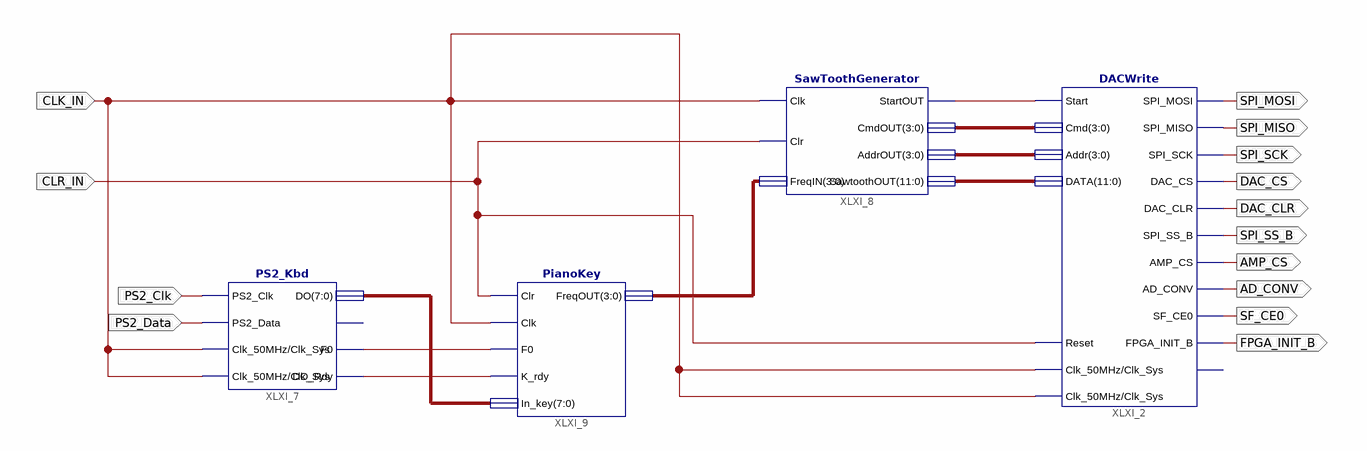
[diagram p0: schematic sheet 1]
// Xilinx ISE schematic SawToothSchematic.sch (spartan3e) as structural Verilog: 4 symbols, 14 ports
module SawToothSchematic (
  input  PS2_Clk,
  input  PS2_Data,
  input  CLK_IN,
  input  CLR_IN,
  output SPI_MOSI,
  output SPI_SCK,
  output SPI_MISO,
  output DAC_CS,
  output DAC_CLR,
  output SPI_SS_B,
  output AMP_CS,
  output AD_CONV,
  output SF_CE0,
  output FPGA_INIT_B
);

  wire XLXN_13, XLXN_45, XLXN_46;
  wire [3:0] XLXN_14, XLXN_15, XLXN_17;
  wire [7:0] XLXN_44;
  wire [11:0] XLXN_16;

  DACWrite XLXI_2 (
    .Reset(CLR_IN), .Start(XLXN_13), .SPI_MISO(SPI_MISO), .Cmd(XLXN_14), .Addr(XLXN_15), .DATA(XLXN_16),
    .DAC_CLR(DAC_CLR), .DAC_CS(DAC_CS), .SPI_MOSI(SPI_MOSI), .SPI_SCK(SPI_SCK), .SPI_SS_B(SPI_SS_B),
    .AMP_CS(AMP_CS), .AD_CONV(AD_CONV), .SF_CE0(SF_CE0), .FPGA_INIT_B(FPGA_INIT_B), .Clk_50MHz(CLK_IN),
    .Clk_Sys(CLK_IN));  // open: Busy
  PS2_Kbd XLXI_7 (
    .PS2_Clk(PS2_Clk), .PS2_Data(PS2_Data), .Clk_50MHz(CLK_IN), .F0(XLXN_45), .DO_Rdy(XLXN_46), .DO(XLXN_44),
    .Clk_Sys(CLK_IN));  // open: E0
  SawToothGenerator XLXI_8 (
    .Clk(CLK_IN), .Clr(CLR_IN), .FreqIN(XLXN_17), .StartOUT(XLXN_13), .CmdOUT(XLXN_14), .AddrOUT(XLXN_15),
    .SawtoothOUT(XLXN_16));
  PianoKey XLXI_9 (.Clr(CLR_IN), .Clk(CLK_IN), .F0(XLXN_45), .K_rdy(XLXN_46), .In_key(XLXN_44), .FreqOUT(XLXN_17));
endmodule
